# Altium schematic sheet CAN System.SchDoc
size A
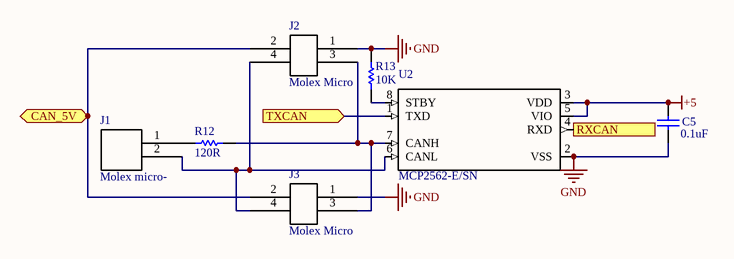
[diagram p0: CAN System.SchDoc]

## Parts
C5  0.1uF  [CAPC2013X94X50LL20T25]
J1  Molex micro-  [0430450227]
J2  Molex Micro  [0430450427]
J3  Molex Micro  [0430450427]
R12  120R  [RESC0805(2012)_N]
R13  10K  [RESC0805(2012)_M]
U2  MCP2562-E/SN  [SOIC127P600X175-8N]

## Ports
CAN_5V (bidir), RXCAN (out), TXCAN (in)

## Nets
+5: C5.1 U2.3(VDD) U2.5(VIO)
GND: C5.2 J2.1 J3.1 R13.2 U2.2(VSS)
CAN_5V: J2.2 J3.2 ; port CAN_5V
RXCAN: U2.4(RXD) ; port RXCAN
TXCAN: U2.1(TXD) ; port TXCAN
NetJ1_1: J1.1 R12.1
NetJ1_2: J1.2 J2.4 J3.4 U2.6(CANL)
NetJ2_3: J2.3 J3.3 R12.2 U2.7(CANH)
NetR13_1: R13.1 U2.8(STBY)

## Library data of the parts
C5 = CMP-2000-05808-1: Chip Capacitor, 0.1 uF, +/- 5%, 50 V, -55 to 125 degC, 0805 (2012 Metric), RoHS, Tape and Reel; Case Width: 1.25mm; Case Length: 2.01mm; Case Height: 0.94mm; Brand: AVX; Type: StandardX7RMLCCs; Capacitance - nF: 100nF; Dissipation Factor DF: 2.5; Voltage Rating DC: 50V; Temperature Coefficient / Code: +/-15%; Capacitance - pF: 100000pF; Dielectric: X7R; Dimensions: 1.25mmWx2.01mmLx0.94mmH; Product: GeneralTypeMLCCs; Package Description: 2-Pin Surface Mount Device, Body 2.01 x 1.25 mm; Capacitance: 0.1uF; Package / Case: 0805(2012metric); Product Category: MultilayerCeramicCapacitorsMLCC-SMD/SMT; Case Code - mm: 2012; Packaging: Reel; Manufacturer URL: http://www.avx.com/; Operating Temperature Range: -55Cto+125C; Termination Style: SMD/SMT; Maximum Operating Temperature: +125C; Case Code - in: 0805; Minimum Operating Temperature: -55C; Factory Pack Quantity: 4000; RoHS: Details; Voltage Rating: 50V; Tolerance: 5%; Package Reference: 0805; Datasheet URL: http://www.farnell.com/datasheets/1679506.pdf; Manufacturer: AVX; Mounting Technology: SurfaceMount; Datasheet Version: 11/2012
J1 = Molex micro-fit 2-pin: Molex micro-fit 3.0. Molex P/N 0430450227
J2 J3 = Molex micro-fit 4-pin (dual row schematic): Molex micro-fit 3.0, P/N 0430450427
R12 = 120R 5% 0805: 120R 0.125W 5% 0805 (2012 Metric)  SMD; Case-Metric: 2012; Value: 120.00 Ohm; Case-EIA: 0805; Tolerance: 5 %; Technology: SMT; Power: 0.125 W
R13 = CMP-1013-00510-1: 1K 0.125W 1% 0805 (2012 Metric)  SMD; Case-Metric: 2012; Value: 1000.00 Ohm; Case-EIA: 0805; Tolerance: 1 %; Power: 0.125 W; Technology: SMT
U2 = MCP2562-E/SN: Microchip MCP2562-E/SN, CAN Transceiver 1MBps 1-channel IEC 61000-4-2, 8-Pin SOIC; Price: None; MF: Microchip; SnapEDA_Link: https://www.snapeda.com/parts/MCP2562-E/SN/Microchip/view-part/?ref=snap; MP: MCP2562-E/SN; Availability: Unavailable; Package: SO-8 Microchip; Value: *